# EAGLE design ctr brd (EAGLE 9.6.2)
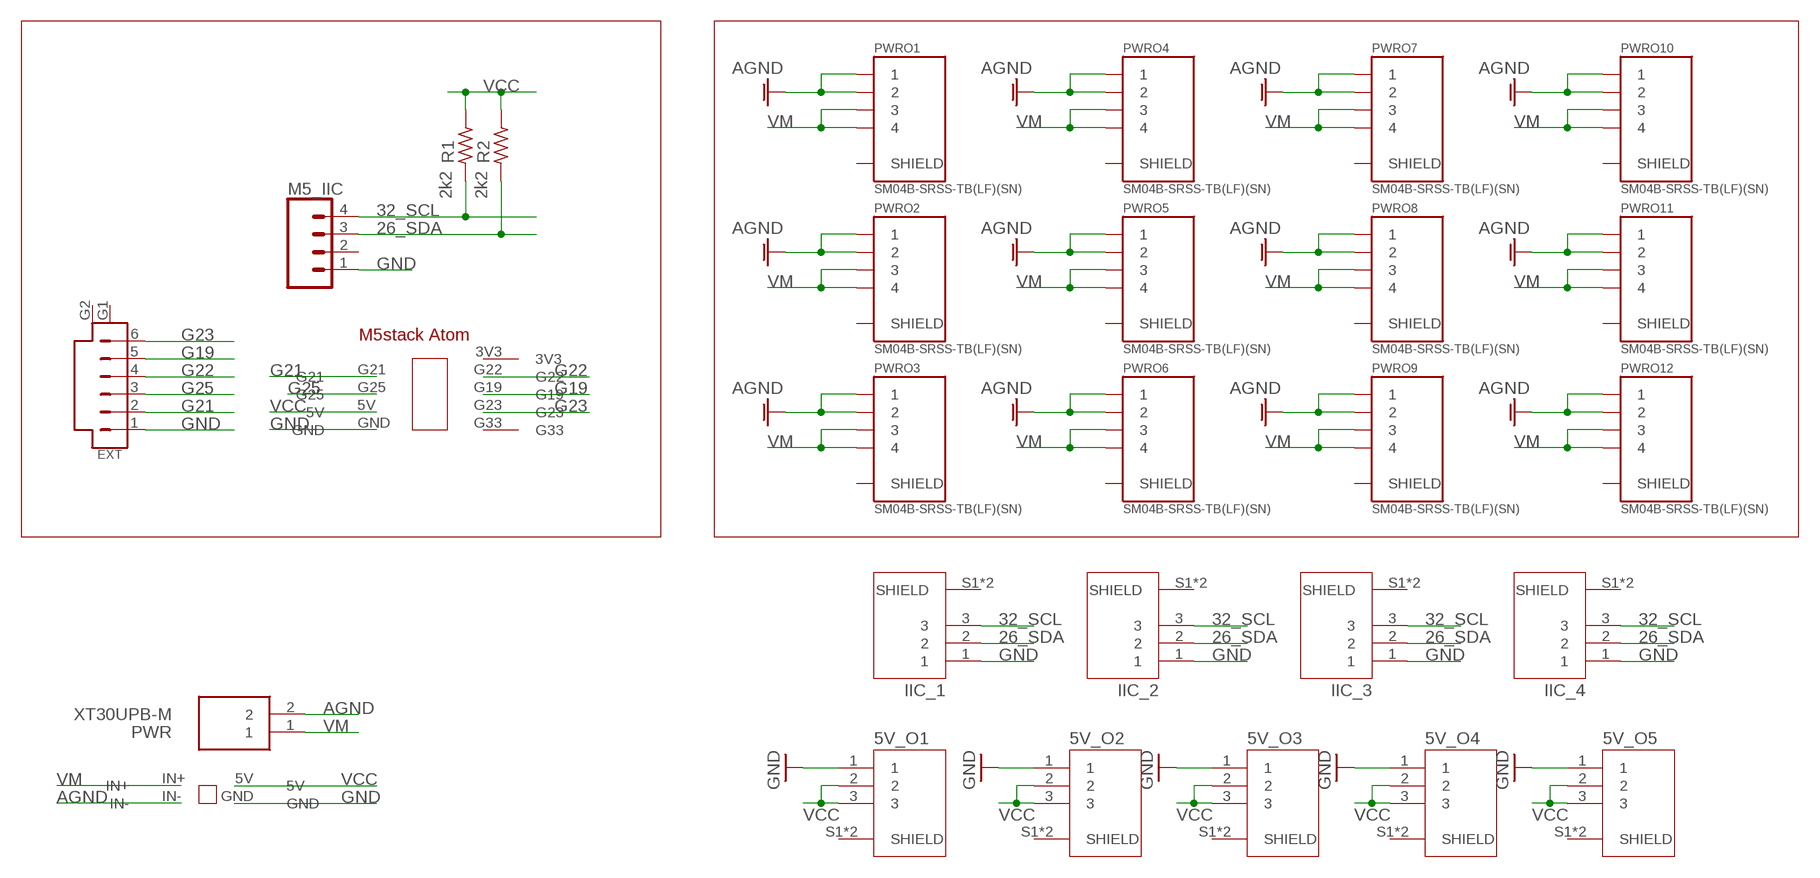
[diagram p0: schematic, sheet 1]

## Parts
5V_O1  SM03B-SRSS-TB(LF)(SN)  [JST_SM03B-SRSS-TB(LF)(SN)]
5V_O2  SM03B-SRSS-TB(LF)(SN)  [JST_SM03B-SRSS-TB(LF)(SN)]
5V_O3  SM03B-SRSS-TB(LF)(SN)  [JST_SM03B-SRSS-TB(LF)(SN)]
5V_O4  SM03B-SRSS-TB(LF)(SN)  [JST_SM03B-SRSS-TB(LF)(SN)]
5V_O5  SM03B-SRSS-TB(LF)(SN)  [JST_SM03B-SRSS-TB(LF)(SN)]
EXT  SM06B-SRSS-TB  [SM06B]
IIC_1  SM03B-SRSS-TB(LF)(SN)  [JST_SM03B-SRSS-TB(LF)(SN)]
IIC_2  SM03B-SRSS-TB(LF)(SN)  [JST_SM03B-SRSS-TB(LF)(SN)]
IIC_3  SM03B-SRSS-TB(LF)(SN)  [JST_SM03B-SRSS-TB(LF)(SN)]
IIC_4  SM03B-SRSS-TB(LF)(SN)  [JST_SM03B-SRSS-TB(LF)(SN)]
M5_IIC  CONN_04JST-PTH  [JST-4-PTH]
PWR  XT30UPB-M  [SHDR2W160P0X500_1X2_1020X520X1]
PWRO1  SM04B-SRSS-TB(LF)(SN)  [JST_SM04B-SRSS-TB(LF)(SN)]
PWRO2  SM04B-SRSS-TB(LF)(SN)  [JST_SM04B-SRSS-TB(LF)(SN)]
PWRO3  SM04B-SRSS-TB(LF)(SN)  [JST_SM04B-SRSS-TB(LF)(SN)]
PWRO4  SM04B-SRSS-TB(LF)(SN)  [JST_SM04B-SRSS-TB(LF)(SN)]
PWRO5  SM04B-SRSS-TB(LF)(SN)  [JST_SM04B-SRSS-TB(LF)(SN)]
PWRO6  SM04B-SRSS-TB(LF)(SN)  [JST_SM04B-SRSS-TB(LF)(SN)]
PWRO7  SM04B-SRSS-TB(LF)(SN)  [JST_SM04B-SRSS-TB(LF)(SN)]
PWRO8  SM04B-SRSS-TB(LF)(SN)  [JST_SM04B-SRSS-TB(LF)(SN)]
PWRO9  SM04B-SRSS-TB(LF)(SN)  [JST_SM04B-SRSS-TB(LF)(SN)]
PWRO10  SM04B-SRSS-TB(LF)(SN)  [JST_SM04B-SRSS-TB(LF)(SN)]
PWRO11  SM04B-SRSS-TB(LF)(SN)  [JST_SM04B-SRSS-TB(LF)(SN)]
PWRO12  SM04B-SRSS-TB(LF)(SN)  [JST_SM04B-SRSS-TB(LF)(SN)]
R1  2k2  R_0603  [R0603]
R2  2k2  R_0603  [R0603]
U$1  M5STACK_ATOM  [M5STACK_ATOM]
U$2  5V_STAB  [5V_STAB]

## Nets
26_SDA: IIC_1.2 IIC_2.2 IIC_3.2 IIC_4.2 M5_IIC.3 R2.1
32_SCL: IIC_1.3 IIC_2.3 IIC_3.3 IIC_4.3 M5_IIC.4 R1.1
AGND: PWR.2 PWRO1.1 PWRO1.2 PWRO2.1 PWRO2.2 PWRO3.1 PWRO3.2 PWRO4.1 PWRO4.2 PWRO5.1 PWRO5.2 PWRO6.1 PWRO6.2 PWRO7.1 PWRO7.2 PWRO8.1 PWRO8.2 PWRO9.1 PWRO9.2 PWRO10.1 PWRO10.2 PWRO11.1 PWRO11.2 PWRO12.1 PWRO12.2 U$2.IN-
G19: EXT.5 U$1.G19
G21: EXT.2 U$1.G21
G22: EXT.4 U$1.G22
G23: EXT.6 U$1.G23
G25: EXT.3 U$1.G25
GND: 5V_O1.1 5V_O2.1 5V_O3.1 5V_O4.1 5V_O5.1 EXT.1 IIC_1.1 IIC_2.1 IIC_3.1 IIC_4.1 M5_IIC.1 U$1.GND U$2.GND
VCC: 5V_O1.2 5V_O1.3 5V_O2.2 5V_O2.3 5V_O3.2 5V_O3.3 5V_O4.2 5V_O4.3 5V_O5.2 5V_O5.3 R1.2 R2.2 U$1.5V U$2.5V
VM: PWR.1 PWRO1.3 PWRO1.4 PWRO2.3 PWRO2.4 PWRO3.3 PWRO3.4 PWRO4.3 PWRO4.4 PWRO5.3 PWRO5.4 PWRO6.3 PWRO6.4 PWRO7.3 PWRO7.4 PWRO8.3 PWRO8.4 PWRO9.3 PWRO9.4 PWRO10.3 PWRO10.4 PWRO11.3 PWRO11.4 PWRO12.3 PWRO12.4 U$2.IN+
Unconnected: 5V_O1.S1(SHIELD) 5V_O1.S2(SHIELD) 5V_O2.S1(SHIELD) 5V_O2.S2(SHIELD) 5V_O3.S1(SHIELD) 5V_O3.S2(SHIELD) 5V_O4.S1(SHIELD) 5V_O4.S2(SHIELD) 5V_O5.S1(SHIELD) 5V_O5.S2(SHIELD) EXT.G1 EXT.G2 IIC_1.S1(SHIELD) IIC_1.S2(SHIELD) IIC_2.S1(SHIELD) IIC_2.S2(SHIELD) IIC_3.S1(SHIELD) IIC_3.S2(SHIELD) IIC_4.S1(SHIELD) IIC_4.S2(SHIELD) M5_IIC.2 PWRO1.S1(SHIELD) PWRO1.S2(SHIELD) PWRO2.S1(SHIELD) PWRO2.S2(SHIELD) PWRO3.S1(SHIELD) PWRO3.S2(SHIELD) PWRO4.S1(SHIELD) PWRO4.S2(SHIELD) PWRO5.S1(SHIELD) PWRO5.S2(SHIELD) PWRO6.S1(SHIELD) PWRO6.S2(SHIELD) PWRO7.S1(SHIELD) PWRO7.S2(SHIELD) PWRO8.S1(SHIELD) PWRO8.S2(SHIELD) PWRO9.S1(SHIELD) PWRO9.S2(SHIELD) PWRO10.S1(SHIELD) PWRO10.S2(SHIELD) PWRO11.S1(SHIELD) PWRO11.S2(SHIELD) PWRO12.S1(SHIELD) PWRO12.S2(SHIELD) U$1.3V3 U$1.G33

## Library data of the parts
5V_O1-5V_O5 IIC_1-IIC_4 = SM03B-SRSS-TB_LF__SN_:SM03B-SRSS-TB(LF)(SN): SH Series 3 Position 1 mm Pitch Surface Mount Side Entry Shrouded Header; AVAILABILITY: Unavailable; DESCRIPTION: Connector Header Surface Mount, Right Angle 3 position 0.039 _1.00mm_; MF: JST Sales; MP: SM03B-SRSS-TB_LF__SN_; PACKAGE: None; PRICE: None
EXT = SM06B-SRSS-TB:SM06B-SRSS-TB: CONN HEADER SH 6POS SIDE 1MM TIN Check prices <https://snapeda.com/parts/SM06B-SRSS-TB/JST%20Sales/view-part/?ref=eda>; AVAILABILITY: Bad; DESCRIPTION: Connector Header Surface Mount, Right Angle 6 position 0.039 (1.00mm); MF: JST Sales; MP: SM06B-SRSS-TB; PACKAGE: None; PRICE: None
M5_IIC = SparkFun-Connectors:CONN_04: Multi connection point. Often used as Generic Header-pin footprint for 0.1 inch spaced/style header connections On any of the 0.1 inch spaced packages, you can populate with these: Break Away Headers - Straight <https://www.sparkfun.com/products/116> (PRT-00116) Break Away Male Headers - Right Angle <https://www.sparkfun.com/products/553> (PRT-00553) Female Headers <https://www.sparkfun.com/products/115> (PRT-00115) Break Away Headers - Machine Pin <https://www.sparkfun.com/products/117> (PRT-00117) Break Away Female Headers - Swiss Machine Pin <https://www.sparkfun.com/products/743> (PRT-00743) For SCREWTERMINALS and SPRING TERMINALS visit here: Screw Terimnals on SparkFun.com <https://www.sparkfun.com/search/results?term=Screw+Terminals> (5mm/3.5mm/2.54mm spacing) This device is also useful as a general connection point to wire up your design to another part of your project. Our various solder wires solder well into these plated through hole pads. Hook-Up Wire - Assortment (Stranded, 22 AWG) <https://www.sparkfun.com/products/11375> (PRT-11375) Hook-Up Wire - Assortment (Solid Core, 22 AWG) <https://www.sparkfun.com/products/11367> (PRT-11367) View the entire wire category on our website here <https://www.sparkfun.com/categories/141> Special notes: Molex polarized connector foot print use with SKU : PRT-08231 with associated crimp pins and housings. 1MM SMD Version SKU: PRT-10208; PROD_ID: WIRE-13531; SF_ID: PRT-09916
PWR = XT30UPB-M:XT30UPB-M: Socket; DC supply; XT30; male; PIN: 2; on PCBs; THT; Colour: yellow Source: Datasheet <https://www.tme.eu/Document/4acc913878197f8c2e30d4b8cdc47230/XT30UPB SPEC.pdf>; DESCRIPTION: Socket; DC supply; XT30; male; PIN: 2; on PCBs; THT; Colour: yellow; HEIGHT: 10.7mm; MANUFACTURER_NAME: Amass; MANUFACTURER_PART_NUMBER: XT30UPB-M
PWRO1-PWRO12 = SM04B-SRSS-TB_LF__SN_:SM04B-SRSS-TB(LF)(SN): SH Series 1.0 mm Pitch 2 Position Single Row Side Entry Shrouded Header Check prices <https://snapeda.com/parts/SM04B-SRSS-TB%28LF%29%28SN%29/JST%20Sales/view-part/?ref=eda>; ARROW_EUROPE-PURCHASE-URL: https://snapeda.com/shop?store=Arrow+Europe&id=557466; AVAILABILITY: Good; DESCRIPTION: Connector Header Surface Mount, Right Angle 4 position 0.039 (1.00mm); DIGIKEY-PURCHASE-URL: https://snapeda.com/shop?store=DigiKey&id=557466; MF: JST Sales; MP: SM04B-SRSS-TB(LF)(SN); PACKAGE: None; PRICE: None
R1 R2 = rc-master-smd:R_: RESISTOR
U$1 = m5stack_atom:M5STACK_ATOM
U$2 = 5v_stab:5V_STAB

## Net classes
0 default: width 0.203 mm

## Board
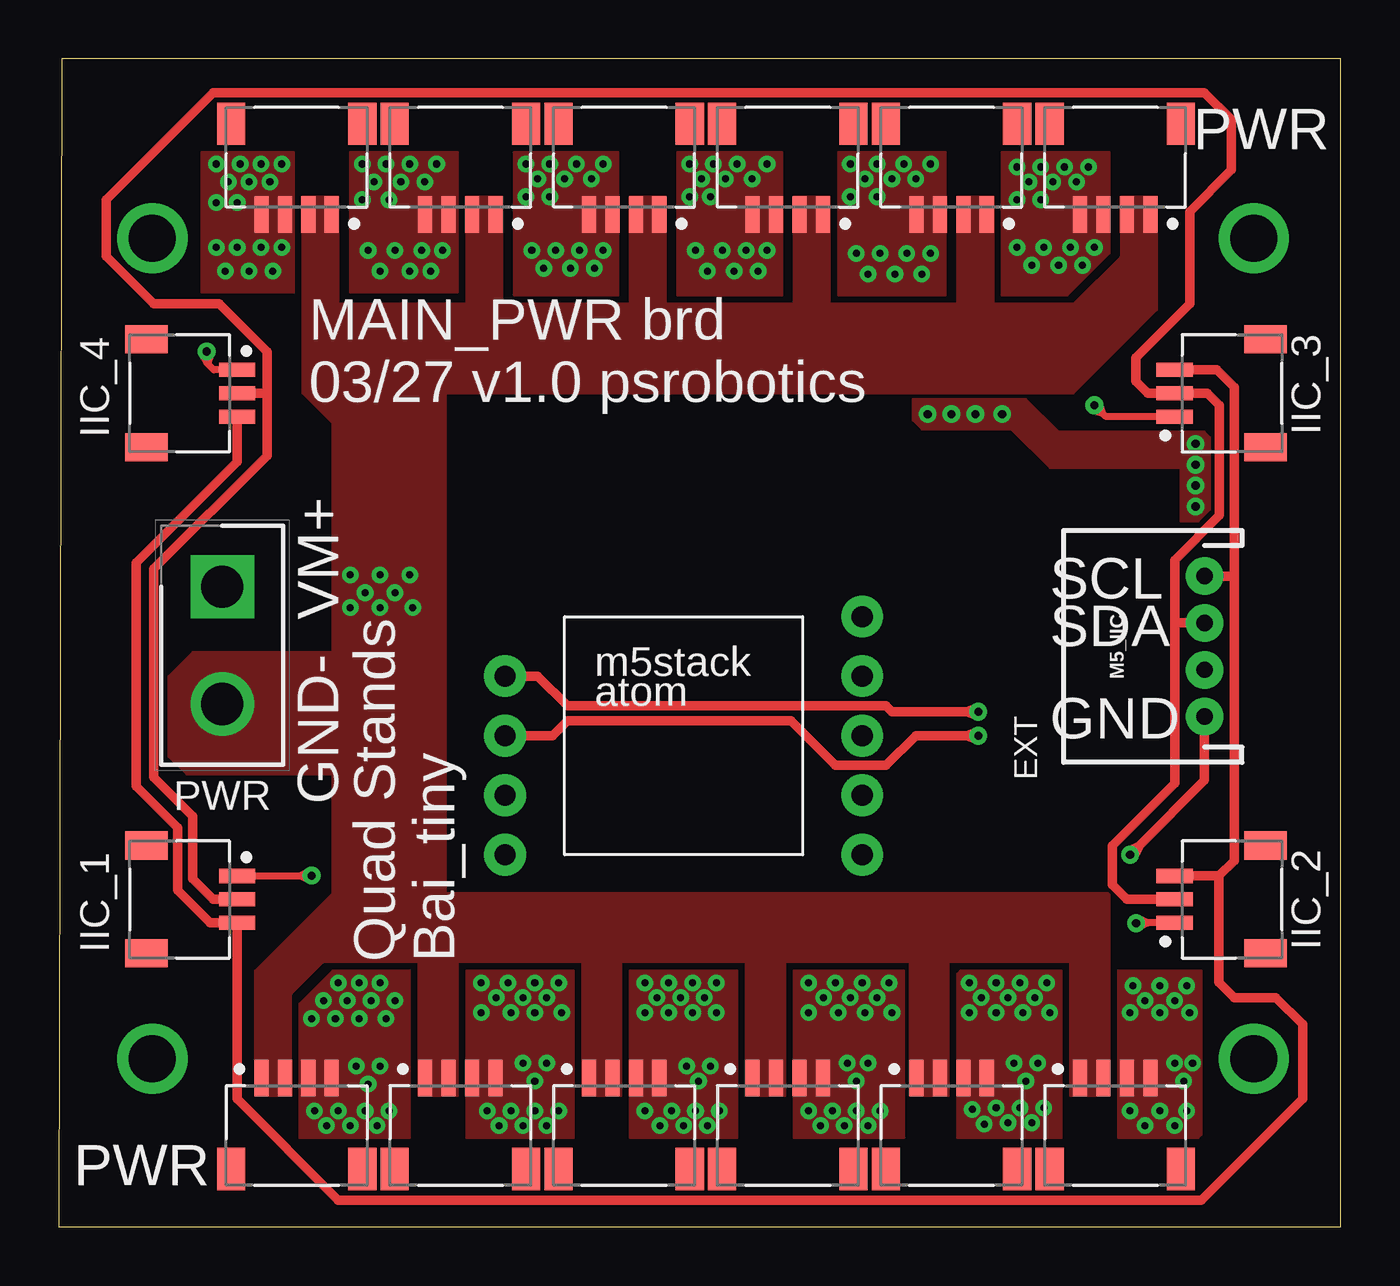
[diagram p1: board, top side]
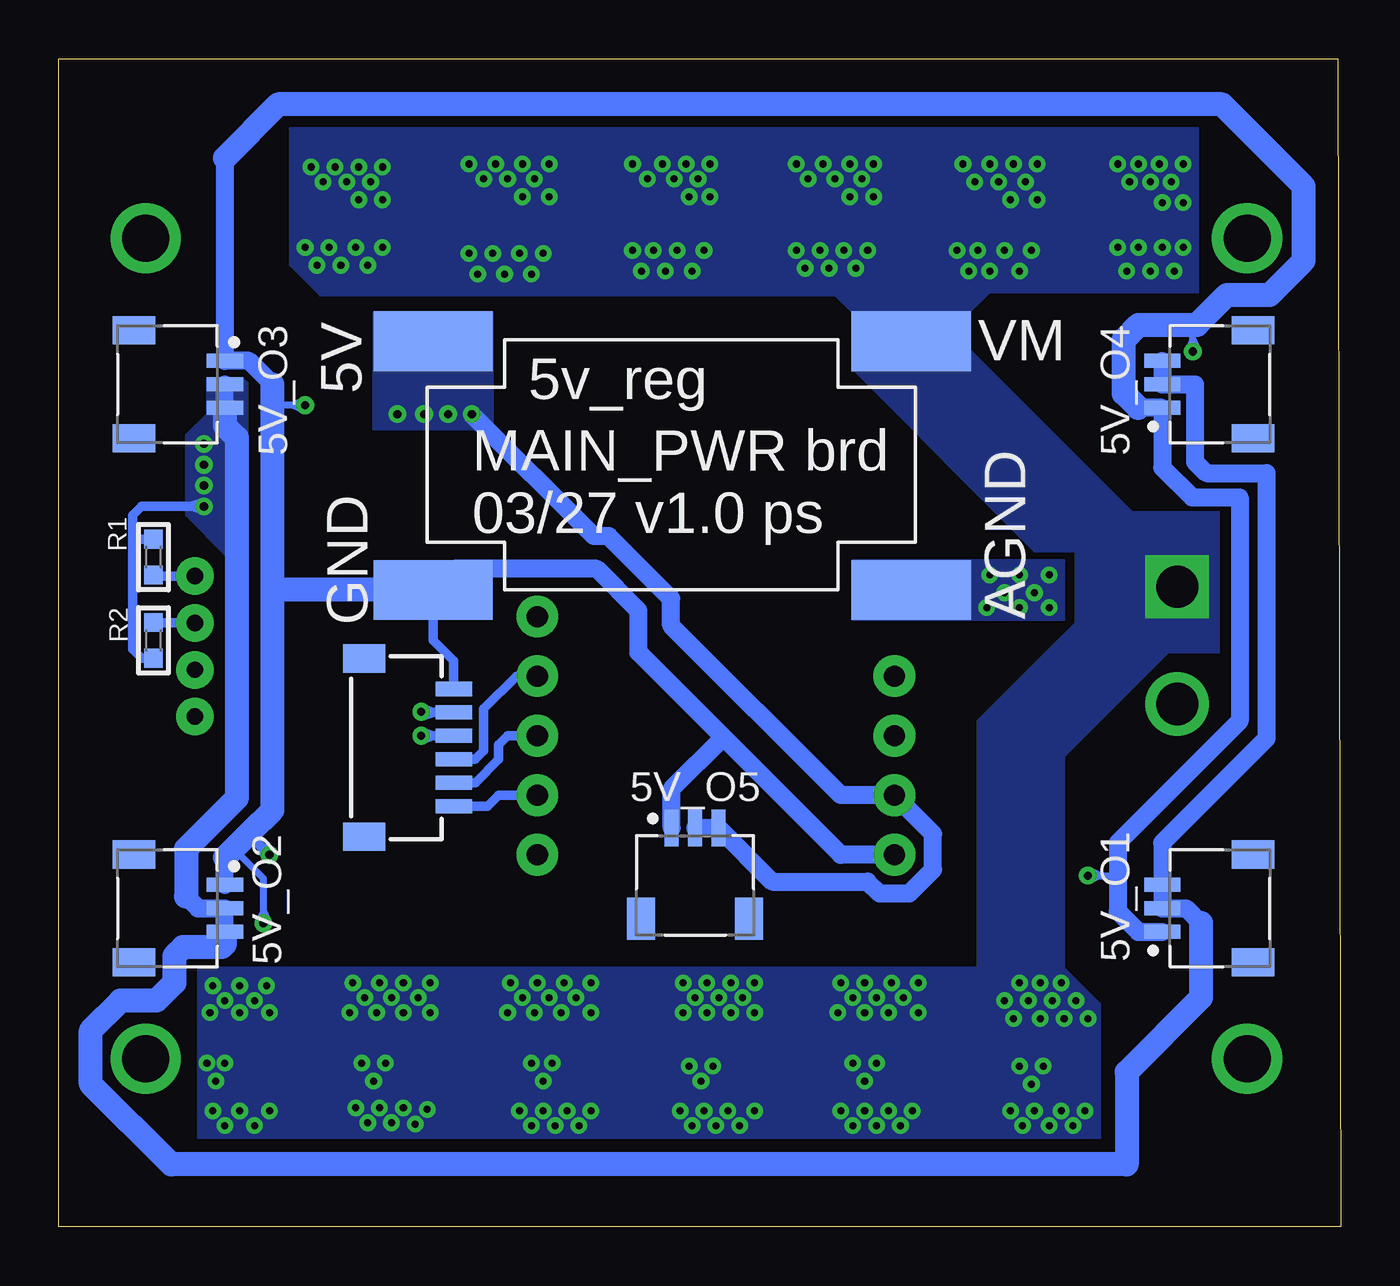
[diagram p2: board, bottom side, seen from below]

Size 54.72 x 49.83 mm. Coordinates in mm from the lower left corner, seen from the top.
Outline: 0,0 54.72,0 54.72,49.83 0.13,49.83 0,0
Copper layers (1*16): Top 0.035mm / dielectric 1.5mm / Bottom 0.035mm
Design rules "default *": minimum track width 6mil, minimum drill 0.35mm, track to track 6mil, track to pad 6mil, pad to pad 6mil, via to via 6mil, smd to smd 6mil, copper to edge 2mil, drill to drill 2mil, minimum pad ring 10mil, minimum via ring 8mil, stop-mask expansion 4mil, vias tented up to drill 12mil, thermal gap 10mil

### Footprints (pad centres in the part's own frame; a part is rotated, then mirrored left to right if it is on the bottom)
JST_SM03B-SRSS-TB(LF)(SN) = smd 0.6 x 1.55: 1 -1,0; 2 0,0; 3 1,0 | smd 1.2 x 1.8: S1 -2.3,-3.875; S2 2.3,-3.875
SM06B = smd 0.6 x 1.55: 1 -2.5,2.275; 2 -1.5,2.275; 3 -0.5,2.275; 4 0.5,2.275; 5 1.5,2.275; 6 2.5,2.275 | smd 1.2 x 1.8: G1 -3.8,-1.55; G2 3.8,-1.55
JST-4-PTH = drill 0.7 pad 1.6: 1 -3,0; 2 -1,0; 3 1,0; 4 3,0
SHDR2W160P0X500_1X2_1020X520X1 = drill 1.8 pad 2.7 square: 1 0,0 | drill 1.8 pad 2.7: 2 5,0
JST_SM04B-SRSS-TB(LF)(SN) = smd 0.6 x 1.55: 1 -1.5,0; 2 -0.5,0; 3 0.5,0; 4 1.5,0 | smd 1.2 x 1.8: S1 -2.8,-3.875; S2 2.8,-3.875
R0603 = smd 0.8 x 0.8: 1 -0.762,0; 2 0.762,0
M5STACK_ATOM = drill 0.9 pad 1.778: 3V3 15.24,10.16; 5V 0,2.54; G19 15.24,5.08; G21 0,7.62; G22 15.24,7.62; G23 15.24,2.54; G25 0,5.08; G33 15.24,0; GND 0,0
5V_STAB = smd 5.08 x 2.54: 5V 0,10.6; GND 0,0; IN+ 20.4,10.6; IN- 20.4,0

### Placement (x,y rotation side)
5V_O1  7.62,13.59 90 bottom
5V_O2  47.62,13.59 270 bottom
5V_O3  47.62,35.94 270 bottom
5V_O4  7.62,35.94 90 bottom
5V_O5  27.56,17.02 0 bottom
EXT  40.13,20.45 270 bottom
IIC_1  7.62,13.97 270 top
IIC_2  47.62,13.97 90 top
IIC_3  47.62,35.56 90 top
IIC_4  7.62,35.56 270 top
M5_IIC  48.9,24.77 90 top
PWR  6.99,27.3 270 top
PWRO1  10.16,6.35 0 top
PWRO2  17.14,6.35 0 top
PWRO3  24.13,6.35 0 top
PWRO4  45.09,6.35 0 top
PWRO5  38.1,6.35 0 top
PWRO6  31.11,6.35 0 top
PWRO7  10.16,43.18 180 top
PWRO8  17.14,43.18 180 top
PWRO9  24.13,43.18 180 top
PWRO10  45.09,43.18 180 top
PWRO11  38.1,43.18 180 top
PWRO12  31.11,43.18 180 top
R1  50.67,28.57 90 bottom
R2  50.67,25.02 270 bottom
U$1  19.05,15.88 0 top
U$2  38.73,27.18 0 bottom

### Tracks (layer width: path | path; a pad name or v marks a point on that pad's centre or on a via)
26_SDA
  Top 0.305: 47.64,25.77 47.62,25.78
  Top 0.406: IIC_1.2 6.6,13.97 5.71,14.86 5.71,17.53 4.06,19.18 4.06,28.07 8.89,32.89 8.89,35.56 | IIC_4.2 8.89,35.56 | IIC_2.2 45.59,13.97 44.96,14.61 44.96,16.26 47.62,18.92 47.62,25.78 47.62,28.45 49.53,30.35 49.53,35.05 49.02,35.56 IIC_3.2 46.48,35.56 45.97,36.07 45.97,37.08 48.26,39.37 48.26,43.31 50.04,45.08 50.04,47.24 48.9,48.39 6.6,48.39 2.03,43.81 2.03,41.4 4.06,39.37 6.86,39.37 8.89,37.34 8.89,35.56 | M5_IIC.3 47.64,25.77
  Bottom 0.406: R2.1 50.66,25.77 M5_IIC.3
32_SCL
  Top 0.305: 50.09,27.77 50.16,27.69
  Top 0.406: IIC_3.3 49.42,36.56 50.16,35.81 50.16,27.69 50.16,15.62 49.51,14.97 | 49.51,14.97 IIC_2.3 | M5_IIC.4 50.09,27.77 | IIC_4.3 7.62,32.64 3.3,28.32 3.3,18.8 5.08,17.02 5.08,14.35 6.46,12.97 IIC_1.3 7.62,5.46 11.94,1.14 48.77,1.14 53.09,5.46 53.09,8.64 51.94,9.78 50.16,9.78 49.51,10.43 49.51,14.97
  Bottom 0.406: R1.1 50.62,27.77 M5_IIC.4
AGND  (via drill 0.3)
  other vias: 12.45,27.81 13.72,27.81 14.99,27.81 13.08,27.05 14.35,27.05 12.45,26.42 13.72,26.42 15.11,26.42
  pour Top (no thermals): 10.41,43.94 11.94,43.94 11.94,39.24 10.41,39.24
  pour Top (no thermals): 10.41,39.37 10.41,35.56 43.31,35.56 46.86,39.12 46.86,43.94 45.34,43.94 45.34,41.4 43.31,39.37
  pour Top (no thermals): 17.4,43.94 18.92,43.94 18.92,39.24 17.4,39.24
  pour Top (no thermals): 24.38,43.94 25.91,43.94 25.91,39.24 24.38,39.24
  pour Top (no thermals): 31.37,43.94 32.89,43.94 32.89,39.24 31.37,39.24
  pour Top (no thermals): 38.35,43.94 39.88,43.94 39.88,39.12 38.35,39.12
  pour Top (no thermals): 44.83,5.59 44.83,14.22 11.68,14.22 8.38,10.92 8.38,5.59 9.91,5.59 9.91,9.91 11.3,11.3 43.18,11.3 43.18,5.59
  pour Top (no thermals): 15.37,5.59 15.37,11.56 17.02,11.56 17.02,5.59
  pour Top (no thermals): 22.35,5.59 22.35,11.56 24,11.56 24,5.59
  pour Top (no thermals): 29.34,5.59 29.34,11.56 30.99,11.56 30.99,5.59
  pour Top (no thermals): 36.32,5.59 36.32,11.56 37.97,11.56 37.97,5.59
  pour Top (no thermals): 15.75,37.21 16.51,36.45 16.51,13.59 12.19,13.59 11.68,14.1 11.68,34.29 10.41,35.56 10.41,37.21
  pour Top (no thermals): 5.71,24.51 12.45,24.51 12.45,19.3 5.46,19.3 4.7,20.07 4.7,23.5
  pour Bottom (no thermals): 20.83,28.45 11.81,28.45 11.81,25.91 20.83,25.91
G19
  Bottom 0.406: EXT.5 36.93,18.95 35.94,19.94 35.94,20.57 35.56,20.96 U$1.G19
G21  (via drill 0.35)
  Top 0.406: v39.24,21.97 38.72,21.97 | 38.72,21.97 35.56,21.97 35.31,22.23 21.72,22.23 20.45,23.5 U$1.G21 | 38.72,21.97 39.19,21.81 | v39.24,21.97 39.19,21.81 | 38.72,21.97 39.19,22.14 | v39.24,21.97 39.19,22.14 | 38.72,21.97 39.19,21.81 | 38.72,21.97 39.19,22.14 | 38.72,21.97 39.19,21.81 | v39.24,21.97 39.19,21.81 | 38.72,21.97 39.19,22.14 | v39.24,21.97 39.19,22.14
  Bottom 0.406: EXT.2 38.72,21.95 | 38.72,21.95 39.22,21.95 v39.24,21.97 | 38.72,21.95 39.19,21.8 v39.24,21.97 | 38.72,21.95 39.18,22.13 v39.24,21.97
G22
  Bottom 0.406: EXT.4 36.95,19.95 36.58,20.32 36.58,22.1 35.18,23.5 U$1.G22
G23
  Bottom 0.406: EXT.6 36.41,17.95 35.94,18.41 U$1.G23
G25  (via drill 0.35)
  Top 0.406: v39.24,20.96 38.72,20.96 | 38.72,20.96 36.58,20.96 35.31,19.69 33.15,19.69 31.24,21.59 21.72,21.59 21.08,20.96 U$1.G25 | 38.72,20.96 39.19,20.79 | v39.24,20.96 39.19,20.79 | 38.72,20.96 39.19,21.12 | v39.24,20.96 39.19,21.12 | 38.72,20.96 39.19,20.79 | 38.72,20.96 39.19,21.12 | 38.72,20.96 39.19,20.79 | v39.24,20.96 39.19,20.79 | 38.72,20.96 39.19,21.12 | v39.24,20.96 39.19,21.12
  Bottom 0.406: EXT.3 38.72,20.95 | 38.72,20.95 v39.23,20.95 v39.24,20.96 | 38.72,20.95 39.19,20.79 v39.24,20.96 | 38.72,20.95 39.18,21.12 v39.24,20.96
GND  (via drill 0.35)
  Top 0.305: IIC_1.1 10.27,14.97 | 10.27,14.97 10.78,14.97 v10.79,14.99 | IIC_4.1 6.62,36.56 6.37,36.81 | v6.31,37.34 6.31,36.87 6.37,36.81 | IIC_2.1 46.5,12.97 | 46.5,12.97 45.99,12.97 v45.97,12.95 | IIC_3.1 44.69,34.56 44.57,34.68 | 44.57,34.68 v44.2,35.05 | 10.27,14.97 10.7,14.78 v10.79,14.99 | 10.27,14.97 10.69,15.19 v10.79,14.99 | 6.37,36.81 6.53,37.26 v6.31,37.34 | 6.37,36.81 6.12,37.22 v6.31,37.34 | 46.5,12.97 46.06,13.16 v45.97,12.95 | 46.5,12.97 46.08,12.75 v45.97,12.95 | 44.57,34.68 44.41,35.13 v44.2,35.05 | 44.57,34.68 44.12,34.84 v44.2,35.05
  Top 0.406: M5_IIC.1 48.9,19.05 46.09,16.25 | 46.09,16.25 v45.72,15.88 | 46.09,16.25 45.65,16.03 v45.72,15.88 | 46.09,16.25 45.88,15.8 v45.72,15.88
  Bottom 0.305: v10.79,14.99 10.27,14.99 | 10.27,14.99 9.53,14.99 | v6.31,37.34 6.31,37.86 | 6.31,37.86 6.31,38.31 6.14,38.48 | v45.97,12.95 45.97,13.48 | 45.97,13.48 45.97,14.86 47.24,16.13 | v44.2,35.05 44.72,35.05 | 44.72,35.05 45.59,35.05 | 10.27,14.99 | 10.27,14.99 | 10.27,14.99 10.7,15.19 | 10.27,14.99 10.7,14.78 | 10.7,14.78 | v10.79,14.99 10.7,14.78 | 10.27,14.99 10.7,15.19 | v10.79,14.99 10.7,15.19 | 10.27,14.99 10.7,14.78 | v10.79,14.99 10.7,14.78 | 10.27,14.99 10.7,15.19 | v10.79,14.99 10.7,15.19 | 6.31,37.86 | 6.31,37.86 | 6.31,37.86 6.52,37.43 | 6.31,37.86 6.11,37.43 | 6.11,37.43 | v6.31,37.34 6.11,37.43 | 6.31,37.86 6.52,37.43 | v6.31,37.34 6.52,37.43 | 6.31,37.86 6.11,37.43 | v6.31,37.34 6.11,37.43 | 6.31,37.86 6.52,37.43 | v6.31,37.34 6.52,37.43 | 45.97,13.48 | 45.97,13.48 | 45.97,13.48 46.18,13.05 | 45.97,13.48 45.77,13.05 | 45.77,13.05 | v45.97,12.95 45.77,13.05 | 45.97,13.48 46.18,13.05 | v45.97,12.95 46.18,13.05 | 45.97,13.48 45.77,13.05 | v45.97,12.95 45.77,13.05 | 45.97,13.48 46.18,13.05 | v45.97,12.95 46.18,13.05 | 44.72,35.05 44.29,35.26 | 44.29,35.26 | v44.2,35.05 44.29,35.26 | 44.72,35.05 44.29,34.85 | v44.2,35.05 44.29,34.85 | 44.72,35.05 44.29,35.26 | v44.2,35.05 44.29,35.26 | 44.72,35.05 44.29,34.85 | v44.2,35.05 44.29,34.85
  Bottom 0.406: v45.72,15.88 46.09,16.25 | 46.09,16.25 46.55,16.7 46.55,16.83 | EXT.1 37.86,24.14 38.73,25.02 U$2.GND | 46.09,16.25 45.65,16.03 v45.72,15.88 | 46.09,16.25 45.88,15.8 v45.72,15.88
  Bottom 0.762: 5V_O1.1 8.65,12.59 9.53,13.46 9.53,14.99 9.53,16.38 4.32,21.59 4.32,31.12 6.35,31.12 7.62,32.38 5V_O4.1 8.65,34.94 | 5V_O2.1 47.62,15.75 | 45.59,35.94 46.59,36.94 5V_O3.1 47.62,45.59 | U$1.GND 21.34,15.88 26.35,20.89 | 26.35,20.89 29.97,24.51 29.97,26.29 31.75,28.07 37.85,28.07 U$2.GND | 5V_O5.1 28.56,18.68 26.35,20.89
  Bottom 1.016: 45.59,27.18 45.59,17.78 46.55,16.83 47.24,16.13 47.62,15.75 | 45.59,27.18 45.59,35.05 45.59,35.94 | 8.65,34.94 9.27,35.56 9.27,37.85 8.64,38.48 6.14,38.48 4.87,39.75 3.04,39.75 1.59,41.21 1.59,44.38 5.08,47.88 45.34,47.88 47.62,45.59 | U$2.GND 45.59,27.18
N$1  (via drill 2)
  other vias: 4,7.17
N$2  (via drill 2)
  other vias: 51,7.17
N$3  (via drill 2)
  other vias: 51,42.17
N$4  (via drill 2)
  other vias: 4,42.17
VCC  (via drill 0.35)
  Bottom 0.406: R2.2 51.18,24.26 51.56,24.64 51.56,29.34 | 51.56,29.34 51.56,30.35 51.18,30.73 49.04,30.73 | 49.04,30.73 v48.51,30.73 | R1.2 51.56,29.34 | 49.04,30.73 48.57,30.9 | v48.51,30.73 48.57,30.9 | 49.04,30.73 48.57,30.57 | v48.51,30.73 48.57,30.57 | 49.04,30.73 48.57,30.9 | 49.04,30.73 48.57,30.57 | 49.04,30.73 48.57,30.9 | v48.51,30.73 48.57,30.9 | 49.04,30.73 48.57,30.57 | v48.51,30.73 48.57,30.57
  Bottom 0.762: 5V_O4.3 5V_O4.2 6.22,35.94 6.22,32.64 5.74,32.16 3.17,32.16 3.17,20.83 7.62,16.38 5V_O1.3 5V_O1.2 6.6,13.59 5.97,12.95 | 49.28,14.1 48.77,13.59 5V_O2.2 5V_O2.3 | 5V_O3.3 5V_O3.2 | v37.08,34.67 31.88,29.46 31.24,29.46 28.57,26.8 28.57,25.65 21.34,18.41 U$1.5V 17.4,16.76 17.4,15.24 18.41,14.22 19.68,14.22 20.19,14.73 24.27,14.73 5V_O5.3 5V_O5.2
  Bottom 1.016: 5V_O3.3 47.62,34.18 47.12,33.67 47.12,18.29 49.28,16.13 49.28,14.1 | 5.97,12.95 5.97,9.78 9.14,6.6 9.14,2.67 49.91,2.67 53.34,6.1 53.34,8.38 52.07,9.65 50.55,9.65 49.78,10.41 49.78,11.56 49.4,11.94 47.75,11.94 47.62,12.07 5V_O2.3
  other vias: 38.1,34.67 39.12,34.67 40.26,34.67 48.51,33.4 48.51,32.51 48.51,31.62
  pour Bottom (no thermals): 46.86,36.2 48.39,36.2 48.39,34.67 49.28,33.78 49.28,30.35 47.62,28.7 46.67,28.7 46.67,36
  pour Bottom (no thermals): 36.2,38.99 36.2,34.04 41.27,34.04 41.27,38.99
  pour Top (no thermals): 36.45,35.31 41.27,35.31 42.67,33.91 48.9,33.91 49.15,33.66 49.15,30.61 48.64,30.1 47.88,30.1 47.88,32.38 42.29,32.38 40.64,34.04 36.83,34.04 36.45,34.42
VM  (via drill 0.3)
  other vias: 11.94,10.41 12.83,10.41 13.72,10.41 11.3,9.65 12.32,9.65 13.34,9.65 14.35,9.65 10.79,8.89 11.81,8.89 12.83,8.89 13.97,8.89 10.92,4.95 11.94,4.95 13.08,4.95 14.1,4.95 11.43,4.32 12.45,4.32 13.59,4.32 12.7,6.86 13.72,6.86 13.21,6.1 18.03,10.41 19.18,10.41 20.32,10.41 21.34,10.41 18.67,9.78 19.81,9.78 20.83,9.78 18.03,9.14 19.3,9.14 20.32,9.14 21.46,9.14 19.81,6.98 20.83,6.98 20.32,6.22 18.29,4.95 19.3,4.95 20.32,4.95 21.34,4.95 18.8,4.32 19.81,4.32 20.83,4.32 25.02,10.41 26.04,10.41 27.05,10.41 28.07,10.41 25.53,9.78 26.54,9.78 27.56,9.78 25.02,9.14 26.04,9.14 27.05,9.14 28.07,9.14 26.8,6.86 27.81,6.86 27.3,6.22 25.02,4.95 26.16,4.95 27.18,4.95 28.19,4.95 25.65,4.32 26.67,4.32 27.69,4.32 32,10.41 33.15,10.41 34.29,10.41 35.43,10.41 32.64,9.78 33.78,9.78 34.92,9.78 32,9.14 33.27,9.14 34.42,9.14 35.56,9.14 33.66,6.98 34.54,6.98 34.04,6.22 32,4.95 33.02,4.95 34.04,4.95 35.05,4.95 32.51,4.32 33.53,4.32 34.54,4.32 38.86,10.41 40.01,10.41 41.02,10.41 42.16,10.41 39.37,9.78 40.51,9.78 41.66,9.78 38.86,9.14 40.01,9.14 41.15,9.14 42.29,9.14 40.77,6.98 41.78,6.98 41.27,6.22 38.99,5.02 40.01,5.08 41.02,5.08 42.04,5.08 39.5,4.38 40.51,4.45 41.53,4.45 45.85,10.29 46.99,10.29 48.13,10.29 46.35,9.65 47.62,9.65 45.72,9.14 46.99,9.14 48.26,9.14 47.62,6.98 48.39,6.98 48.01,6.22 45.72,4.95 46.99,4.95 48.13,4.95 47.62,4.32 46.35,4.32 6.73,45.34 7.75,45.34 8.64,45.34 9.53,45.34 9.02,44.58 8.13,44.58 7.24,44.58 6.73,43.69 7.62,43.69 6.73,41.78 7.62,41.78 8.64,41.78 9.53,41.78 7.11,40.77 8.13,40.77 9.14,40.77 12.95,45.34 13.97,45.34 14.99,45.34 16.13,45.34 13.46,44.58 14.61,44.58 15.62,44.58 12.95,43.81 14.1,43.81 13.21,41.66 14.35,41.66 15.49,41.66 16.38,41.66 13.72,40.77 14.99,40.77 15.88,40.77 19.94,45.34 20.95,45.34 22.1,45.34 23.24,45.34 20.45,44.7 21.59,44.7 22.73,44.7 19.94,43.94 20.95,43.94 20.19,41.66 21.21,41.66 22.23,41.66 23.24,41.66 20.7,40.89 21.84,40.89 22.86,40.89 26.92,45.34 27.94,45.34 28.96,45.34 30.23,45.34 27.43,44.7 28.45,44.7 29.59,44.7 26.92,43.94 27.81,43.94 27.18,41.66 28.32,41.66 29.34,41.66 30.23,41.66 27.69,40.77 28.83,40.77 29.84,40.77 33.78,45.34 34.92,45.34 36.07,45.34 37.21,45.34 34.42,44.7 35.56,44.7 36.58,44.7 33.78,43.94 34.92,43.94 34.04,41.53 35.05,41.53 36.2,41.53 37.21,41.53 34.54,40.64 35.69,40.64 36.83,40.64 40.89,45.21 41.91,45.21 42.93,45.21 43.94,45.21 41.4,44.58 42.42,44.58 43.43,44.58 40.89,43.81 41.91,43.81 40.89,41.78 42.04,41.78 43.18,41.78 44.2,41.78 41.53,41.02 42.67,41.02 43.69,41.02
  pour Bottom (no thermals): 20.83,36.58 20.83,38.99 21.59,39.75 43.56,39.75 44.83,41.02 44.83,46.86 6.1,46.86 6.1,39.88 14.99,39.88 15.88,38.99 15.88,36.58
  pour Bottom (no thermals): 48.77,3.81 48.77,11.05 11.81,11.05 10.29,9.52 10.29,3.81
  pour Top (no thermals): 10.29,9.52 10.29,3.81 14.99,3.81 14.99,10.92 11.68,10.92
  pour Top (no thermals): 17.4,10.92 17.4,3.81 21.97,3.81 21.97,10.92
  pour Top (no thermals): 24.38,10.92 24.38,3.81 28.96,3.81 28.96,10.92
  pour Top (no thermals): 31.37,10.92 31.37,3.81 36.07,3.81 36.07,10.92
  pour Top (no thermals): 38.35,7.11 38.35,3.81 42.8,3.81 42.8,10.92 38.48,10.92 38.35,10.79
  pour Top (no thermals): 45.21,10.92 45.21,3.81 48.64,3.81 48.77,3.94 48.77,10.92
  pour Top (no thermals): 10.03,45.85 10.03,39.88 6.1,39.88 6.1,45.85
  pour Top (no thermals): 17.02,45.85 17.02,39.88 12.45,39.88 12.45,45.85
  pour Top (no thermals): 23.88,45.85 23.88,39.75 19.43,39.75 19.43,45.85
  pour Top (no thermals): 30.86,45.85 30.86,39.75 26.42,39.75 26.42,45.85
  pour Top (no thermals): 37.85,45.85 37.85,39.75 33.27,39.75 33.27,45.85
  pour Top (no thermals): 44.83,45.85 44.83,41.53 43.05,39.75 40.26,39.75 40.26,45.85
  pour Bottom (no thermals): 15.75,37.34 8.89,30.48 5.21,30.48 5.21,24.51 7.37,24.51 11.81,20.07 11.81,10.92 15.49,10.92 15.49,21.59 11.3,25.78 11.3,28.83 13.08,28.83 20.83,36.58 20.83,37.34

### Text on the board
tPlace: PWR | MAIN_PWR brd / 03/27 v1.0 psrobotics | SCL | VM+ | SDA | GND | GND- | Quad Stands | Bai_tiny | PWR
bPlace: 5V | VM | AGND | GND | MAIN_PWR brd / 03/27 v1.0 ps